# EAGLE design External_Controls_Board (EAGLE 6.6.0)
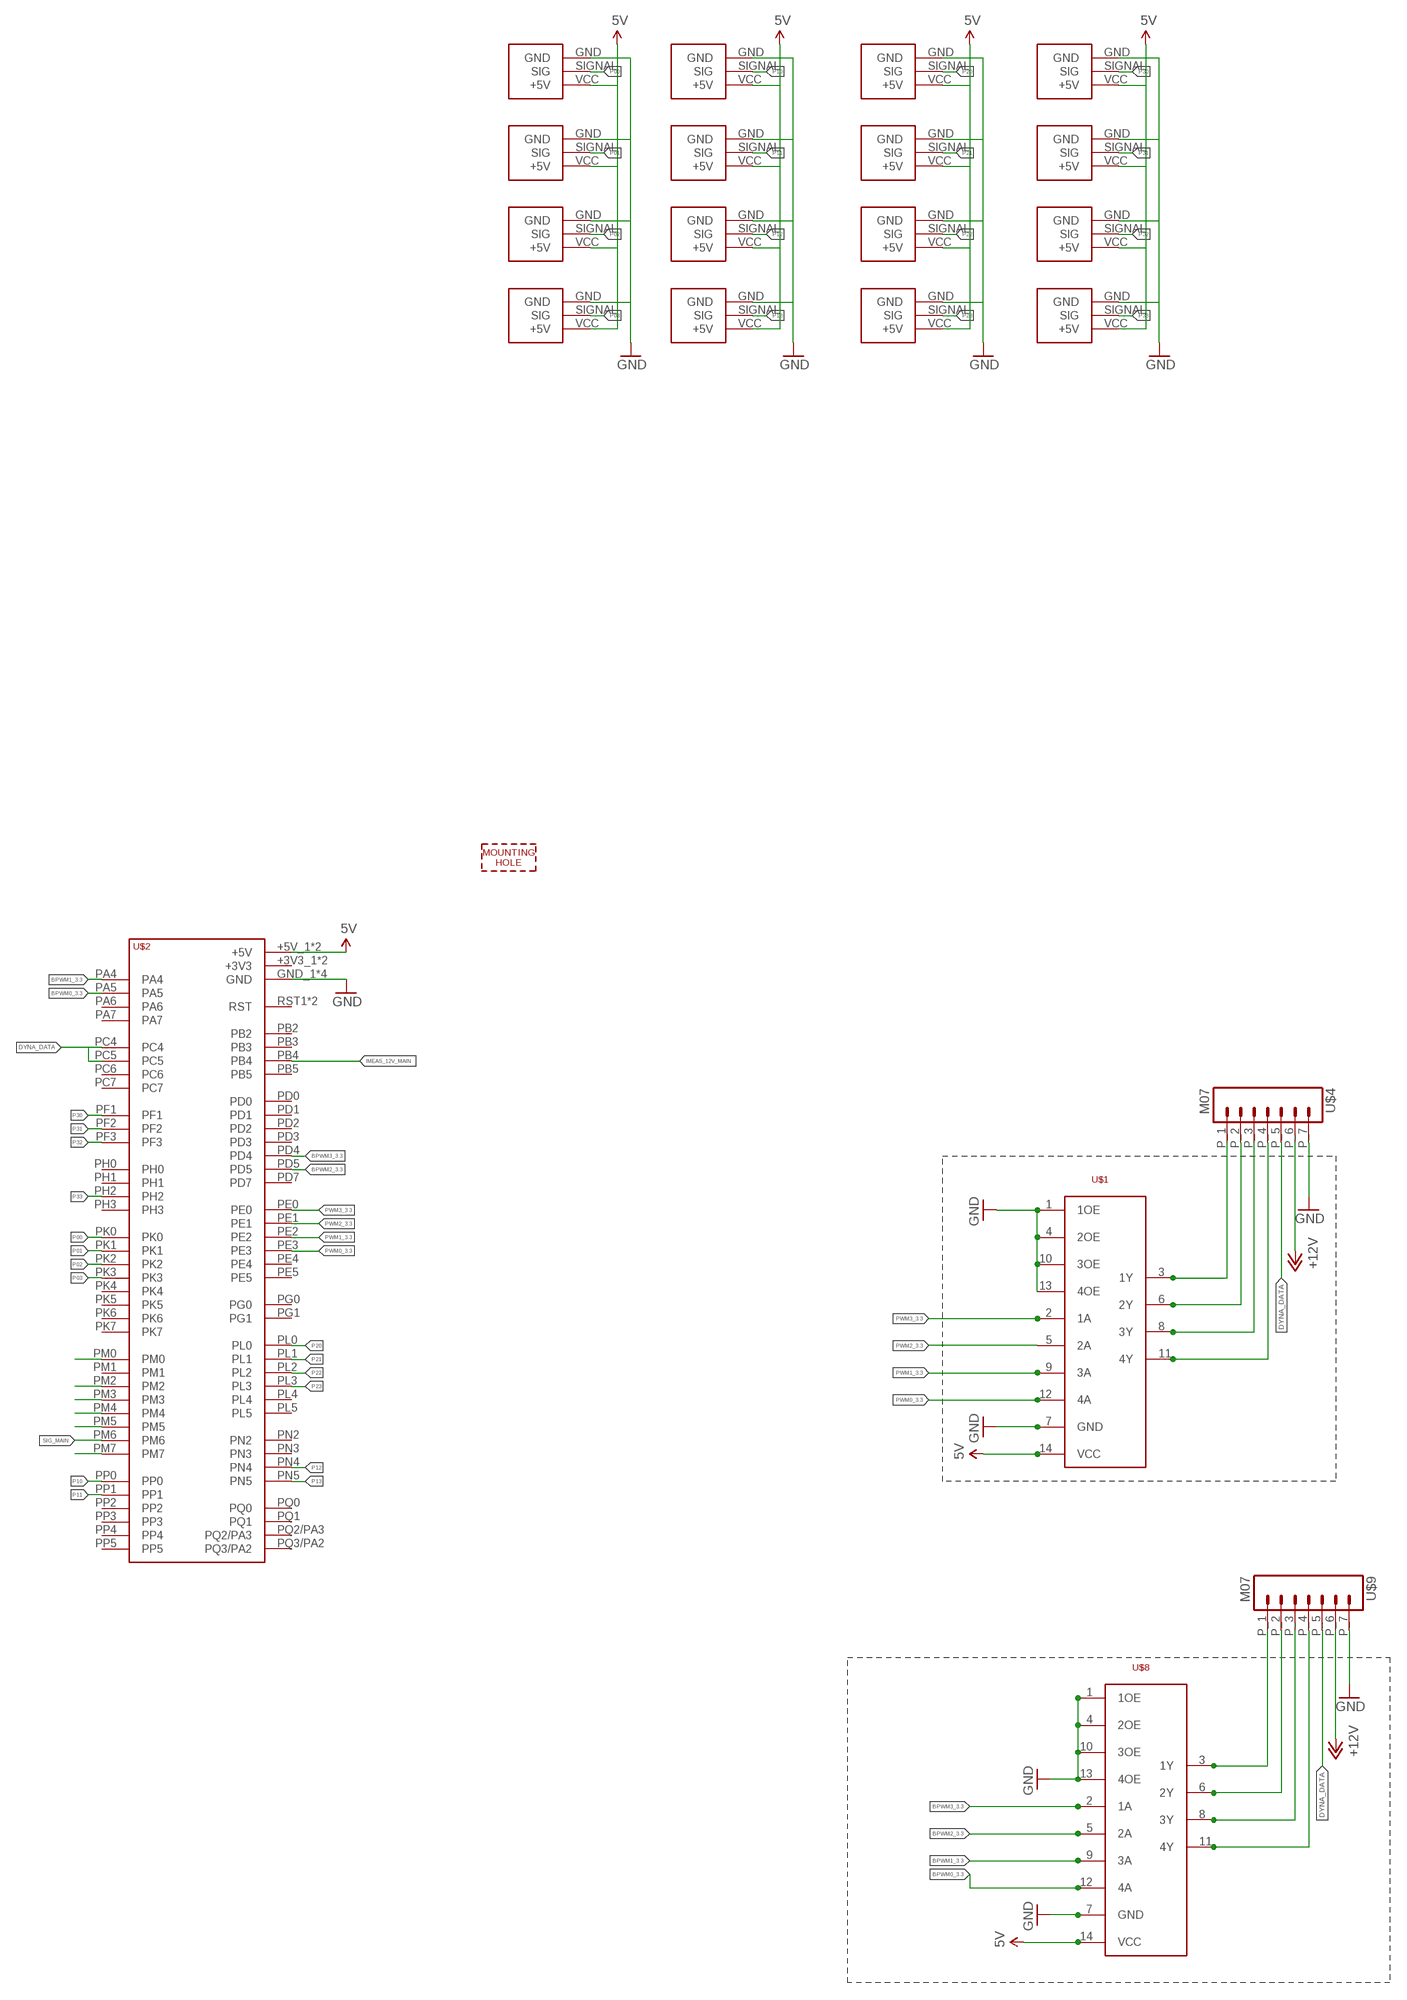
[diagram p0: schematic, sheet 1, part 1 of 2]
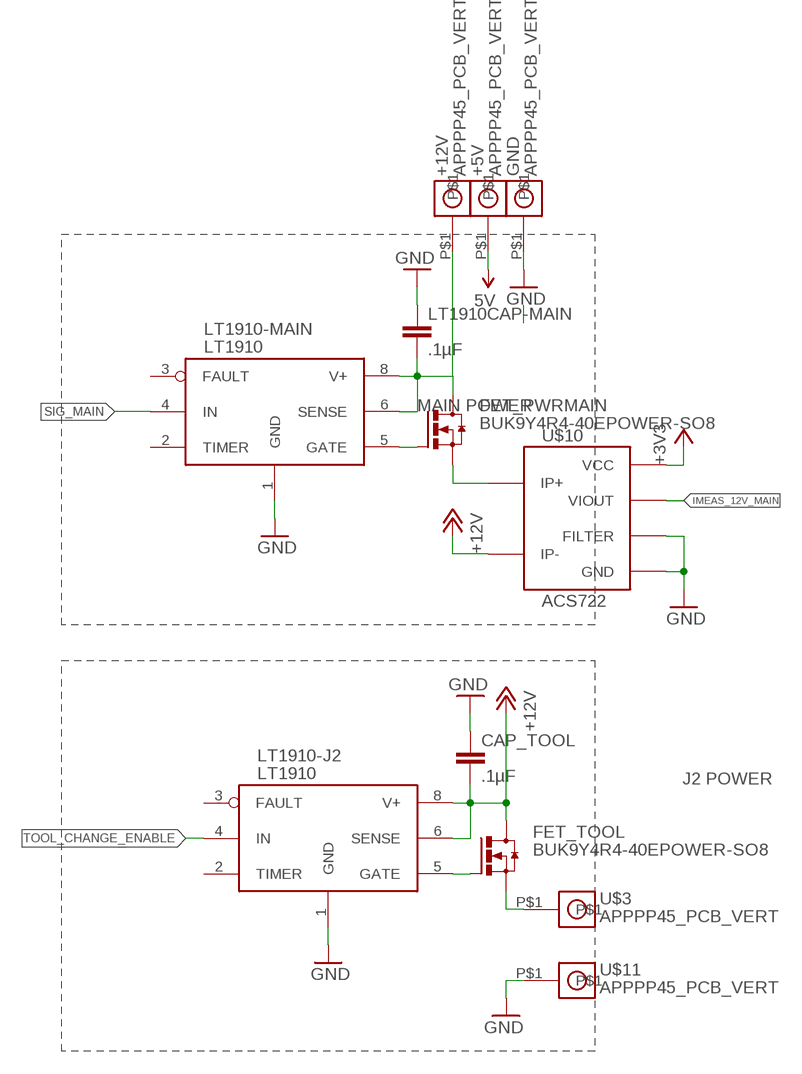
[diagram p1: schematic, sheet 1, part 2 of 2]

## Parts
+5V  APPPP45_PCB_VERT  [APP45_PCB_VERT]
+12V  APPPP45_PCB_VERT  [APP45_PCB_VERT]
CAP_TOOL  .1µF  CAP0603-CAP  [0603-CAP]
FET_PWRMAIN  BUK9Y4R4-40EPOWER-SO8  [POWER-SO8]
FET_TOOL  BUK9Y4R4-40EPOWER-SO8  [POWER-SO8]
GND  APPPP45_PCB_VERT  [APP45_PCB_VERT]
LT1910-J2  LT1910  [SO8]
LT1910-MAIN  LT1910  [SO8]
LT1910CAP-MAIN  .1µF  CAP0603-CAP  [0603-CAP]
S00  SERVO  [SERVO_JACK]
S01  SERVO  [SERVO_JACK]
S02  SERVO  [SERVO_JACK]
S03  SERVO  [SERVO_JACK]
S10  SERVO  [SERVO_JACK]
S11  SERVO  [SERVO_JACK]
S12  SERVO  [SERVO_JACK]
S13  SERVO  [SERVO_JACK]
S20  SERVO  [SERVO_JACK]
S21  SERVO  [SERVO_JACK]
S22  SERVO  [SERVO_JACK]
S23  SERVO  [SERVO_JACK]
S30  SERVO  [SERVO_JACK]
S31  SERVO  [SERVO_JACK]
S32  SERVO  [SERVO_JACK]
S33  SERVO  [SERVO_JACK]
U$1  SN74AHCT125  [SOIC14]
U$2  TIVA-C-CONNECTED  [TIVA-C-CONNECTED]
U$3  APPPP45_PCB_VERT  [APP45_PCB_VERT]
U$4  M07  [MOLEX_43650-07]
U$6  MOUNTING_HOLE#8  [#8_SCREW]
U$8  SN74AHCT125  [SOIC14]
U$9  M07  [MOLEX_43650-07]
U$10  ACS722  [SO-08]
U$11  APPPP45_PCB_VERT  [APP45_PCB_VERT]

## Nets
+3V3: U$10.8(VCC)
+5V: +5V.P$1 S00.VCC(+5V) S01.VCC(+5V) S02.VCC(+5V) S03.VCC(+5V) S10.VCC(+5V) S11.VCC(+5V) S12.VCC(+5V) S13.VCC(+5V) S20.VCC(+5V) S21.VCC(+5V) S22.VCC(+5V) S23.VCC(+5V) S30.VCC(+5V) S31.VCC(+5V) S32.VCC(+5V) S33.VCC(+5V) U$1.14(VCC) U$2.+5V_1(+5V) U$2.+5V_2(+5V) U$8.14(VCC) ; supply symbol labelled 5V
+12V: CAP_TOOL.2 FET_TOOL.5(D) FET_TOOL.6(D) FET_TOOL.7(D) FET_TOOL.8(D) LT1910-J2.6(SENSE) LT1910-J2.8(V+) U$4.P_6 U$9.P_6 U$10.3(IP-) U$10.4(IP-)
BPWM0_3.3: U$2.PA5 U$8.12(4A)
BPWM1_3.3: U$2.PA4 U$8.9(3A)
BPWM2_3.3: U$2.PD5 U$8.5(2A)
BPWM3_3.3: U$2.PD4 U$8.2(1A)
DYNA_DATA: U$2.PC4 U$2.PC5 U$4.P_5 U$9.P_5
GATE-J2: FET_TOOL.4(G) LT1910-J2.5(GATE)
GATE-MAIN: FET_PWRMAIN.4(G) LT1910-MAIN.5(GATE)
GND: CAP_TOOL.1 GND.P$1 LT1910-J2.1(GND) LT1910-MAIN.1(GND) LT1910CAP-MAIN.1 S00.GND S01.GND S02.GND S03.GND S10.GND S11.GND S12.GND S13.GND S20.GND S21.GND S22.GND S23.GND S30.GND S31.GND S32.GND S33.GND U$1.1(1OE) U$1.4(2OE) U$1.7(GND) U$1.10(3OE) U$1.13(4OE) U$2.GND_1(GND) U$2.GND_2(GND) U$2.GND_3(GND) U$2.GND_4(GND) U$4.P_7 U$8.1(1OE) U$8.4(2OE) U$8.7(GND) U$8.10(3OE) U$8.13(4OE) U$9.P_7 U$10.5(GND) U$10.6(FILTER) U$11.P$1
IMEAS_12V_MAIN: U$2.PB4 U$10.7(VIOUT)
N$2: +12V.P$1 FET_PWRMAIN.5(D) FET_PWRMAIN.6(D) FET_PWRMAIN.7(D) FET_PWRMAIN.8(D) LT1910-MAIN.6(SENSE) LT1910-MAIN.8(V+) LT1910CAP-MAIN.2
P00: S00.SIGNAL(SIG) U$2.PK0
P01: S01.SIGNAL(SIG) U$2.PK1
P02: S02.SIGNAL(SIG) U$2.PK2
P03: S03.SIGNAL(SIG) U$2.PK3
P10: S10.SIGNAL(SIG) U$2.PP0
P11: S11.SIGNAL(SIG) U$2.PP1
P12: S12.SIGNAL(SIG) U$2.PN4
P13: S13.SIGNAL(SIG) U$2.PN5
P20: S20.SIGNAL(SIG) U$2.PL0
P21: S21.SIGNAL(SIG) U$2.PL1
P22: S22.SIGNAL(SIG) U$2.PL2
P23: S23.SIGNAL(SIG) U$2.PL3
P30: S30.SIGNAL(SIG) U$2.PF1
P31: S31.SIGNAL(SIG) U$2.PF2
P32: S32.SIGNAL(SIG) U$2.PF3
P33: S33.SIGNAL(SIG) U$2.PH2
PWM0_1: U$8.11(4Y) U$9.P_4
PWM0_3.3: U$1.12(4A) U$2.PE3
PWM0_5: U$1.11(4Y) U$4.P_4
PWM1_1: U$8.8(3Y) U$9.P_3
PWM1_3.3: U$1.9(3A) U$2.PE2
PWM1_5: U$1.8(3Y) U$4.P_3
PWM2_1: U$8.6(2Y) U$9.P_2
PWM2_3.3: U$1.5(2A) U$2.PE1
PWM2_5: U$1.6(2Y) U$4.P_2
PWM3_1: U$8.3(1Y) U$9.P_1
PWM3_3.3: U$1.2(1A) U$2.PE0
PWM3_5: U$1.3(1Y) U$4.P_1
SERVO_SIG_8: U$2.PM0
SERVO_SIG_10: U$2.PM2
SERVO_SIG_11: U$2.PM3
SERVO_SIG_12: U$2.PM4
SERVO_SIG_13: U$2.PM5
SERVO_SIG_15: U$2.PM7
SIG_MAIN: LT1910-MAIN.4(IN) U$2.PM6
SOURCE-MAIN: FET_PWRMAIN.1(S) FET_PWRMAIN.2(S) FET_PWRMAIN.3(S) U$10.1(IP+) U$10.2(IP+)
TOOL: FET_TOOL.1(S) FET_TOOL.2(S) FET_TOOL.3(S) U$3.P$1
TOOL_CHANGE_ENABLE: LT1910-J2.4(IN)
Unconnected: LT1910-J2.2(TIMER) LT1910-J2.3(FAULT) LT1910-MAIN.2(TIMER) LT1910-MAIN.3(FAULT) U$2.+3V3_1(+3V3) U$2.+3V3_2(+3V3) U$2.PA6 U$2.PA7 U$2.PB2 U$2.PB3 U$2.PB5 U$2.PC6 U$2.PC7 U$2.PD0 U$2.PD1 U$2.PD2 U$2.PD3 U$2.PD7 U$2.PE4 U$2.PE5 U$2.PG0 U$2.PG1 U$2.PH0 U$2.PH1 U$2.PH3 U$2.PK4 U$2.PK5 U$2.PK6 U$2.PK7 U$2.PL4 U$2.PL5 U$2.PM1 U$2.PN2 U$2.PN3 U$2.PP2 U$2.PP3 U$2.PP4 U$2.PP5 U$2.PQ0 U$2.PQ1 U$2.PQ2/PA3 U$2.PQ3/PA2 U$2.RST1(RST) U$2.RST_2(RST)

## Notes on the sheet
- MAIN POWER
- J2 POWER

## Library data of the parts
+5V +12V GND U$3 U$11 = MRDT-Connectors:APP: http://www.powerwerx.com/anderson-powerpoles/
CAP_TOOL LT1910CAP-MAIN = SparkFun-Capacitors:CAP: Capacitor Standard 0603 ceramic capacitor, and 0.1" leaded capacitor.
FET_PWRMAIN FET_TOOL = MRDT-2015-General:BUK9Y4R4-40E; MFR: NXP; MFR_PN: BUK9Y4R4-40E; PACKAGE: POWER-SO8
LT1910-J2 LT1910-MAIN = Jake:LT1910
S00 S01-S03 S10-S13 S20-S23 S30-S33 = MRDT-2015-General:SERVO
U$1 U$8 = MRDT-Digital-ICs:SN74AHCT125: part # SN74AHCT125 QUADRUPLE BUS BUFFER GATES WITH 3-STATE OUTPUTS http://www.digikey.com/product-detail/en/SN74AHCT125DR/296-4652-1-ND/405208
U$2 = MRDT-2015-General:TIVA-C-CONNECTED: TIVA C CONNECTED LAUNCHPAD
U$4 U$9 = MRDT-Connectors:M07
U$6 = MRDT-Hardware:MOUNTING_HOLE: Mounting hole for M6 bolt. Standard use mounting hole for: Tiva C Connected - M6 Anderson Powerpole Mounting Wing - M8 Most frame-mounted PCB's - M8
U$10 = MRDT-PowerICs:ACS722

## Board
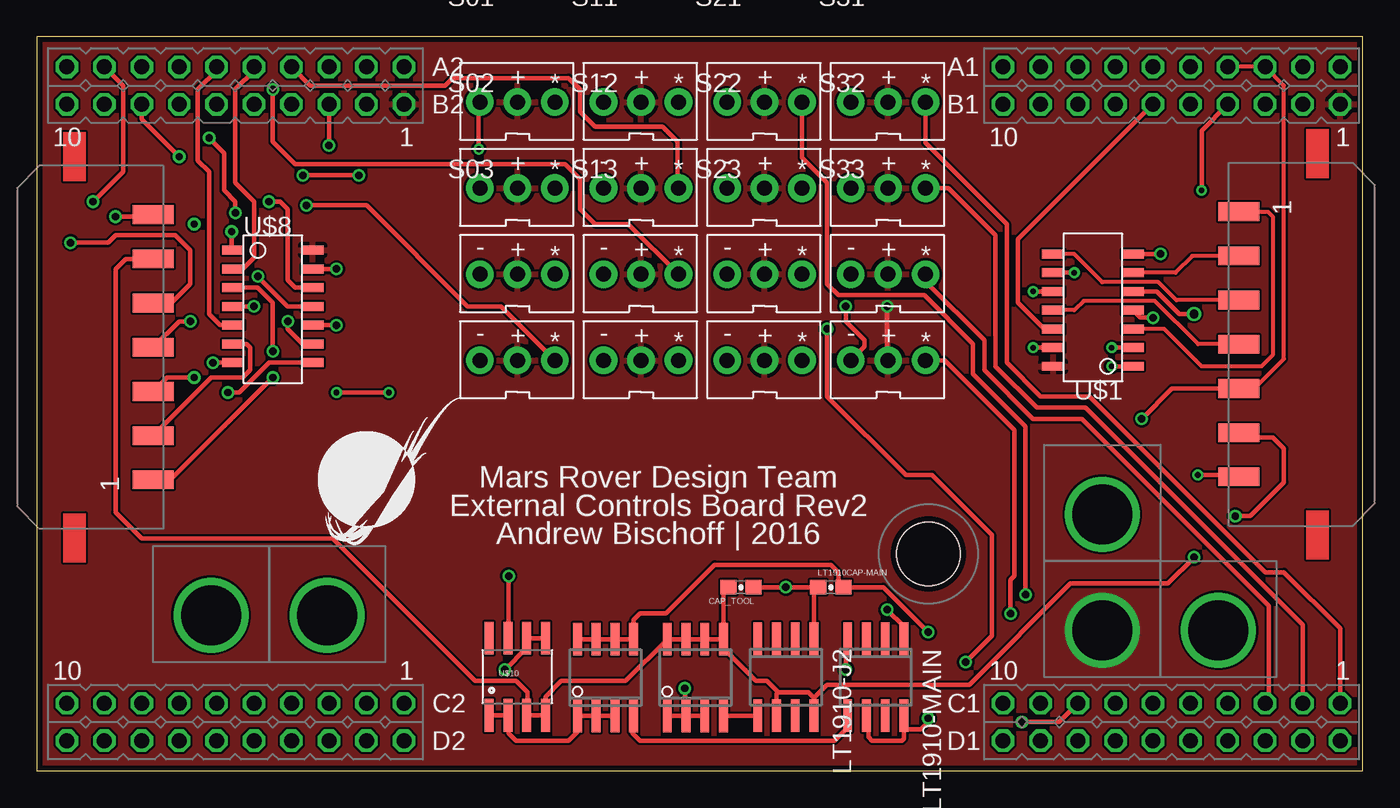
[diagram p2: board, top side]
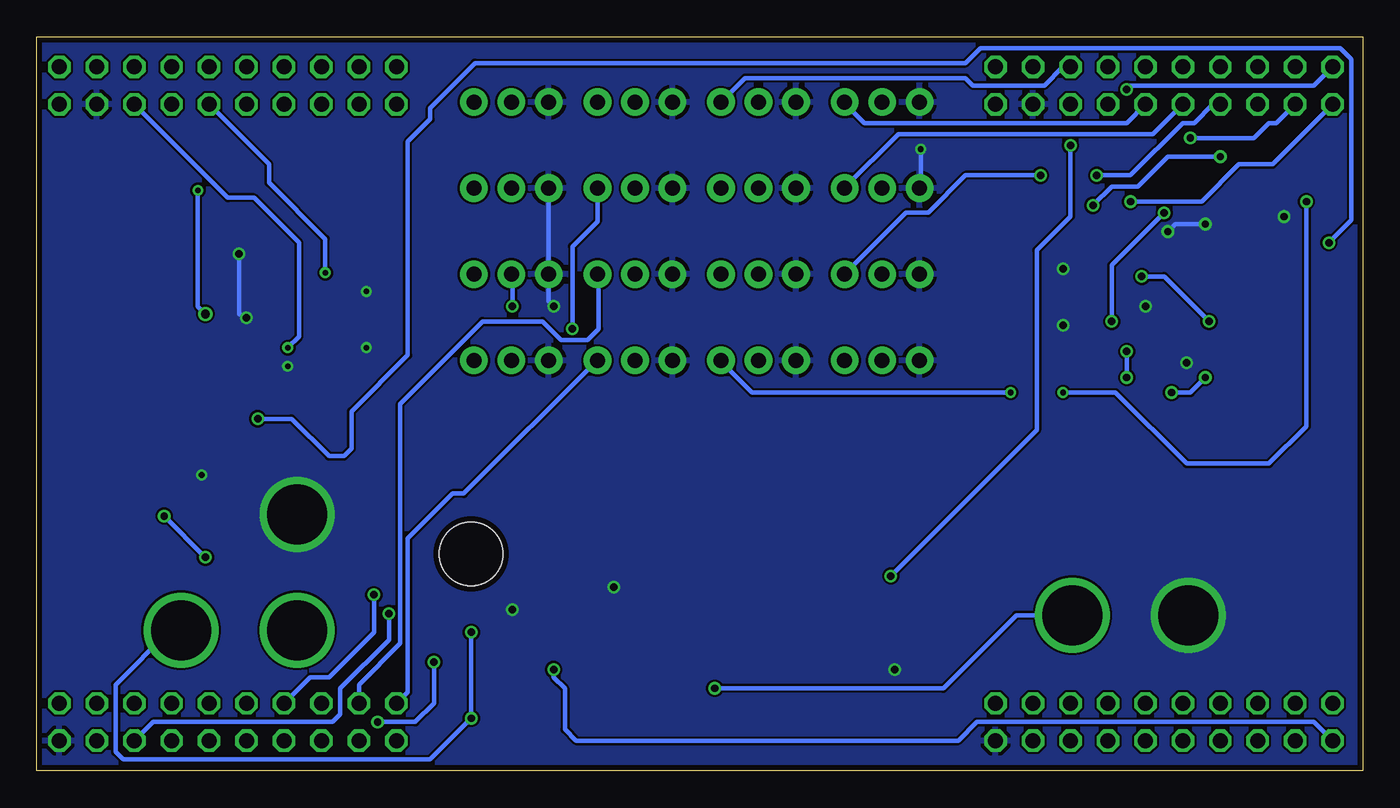
[diagram p3: board, bottom side, seen from below]

Size 89.92 x 49.78 mm. Coordinates in mm from the lower left corner, seen from the top.
Outline: 0,0 89.92,0 89.92,49.78 0,49.78 0,0
Copper layers (1*16): Top 0.0356mm / dielectric 1.5011mm / Bottom 0.0356mm
Design rules "LaenPCBOrder": minimum track width 6mil, minimum drill 13mil, track to track 6mil, track to pad 6mil, pad to pad 6mil, via to via 6mil, smd to smd 6mil, copper to edge 15mil, drill to drill 6mil, minimum pad ring 7mil, minimum via ring 7mil, stop-mask expansion 3mil, vias tented up to drill 0mil, thermal gap 10mil

### Footprints (pad centres in the part's own frame; a part is rotated, then mirrored left to right if it is on the bottom)
APP45_PCB_VERT = drill 4.064: P$1 3.937,3.175
0603-CAP = smd 1.1 x 1: 1 -0.85,0; 2 0.85,0
POWER-SO8 = smd 0.6 x 2.2: 1 0.595,-0.6; 2 1.865,-0.6; 3 3.135,-0.6; 4 4.405,-0.6; 5 4.405,4.6; 6 3.135,4.6; 7 1.865,4.6; 8 0.595,4.6
SO8 = smd 0.6 x 2.2: 1 -1.905,-2.6; 2 -0.635,-2.6; 3 0.635,-2.6; 4 1.905,-2.6; 5 1.905,2.6; 6 0.635,2.6; 7 -0.635,2.6; 8 -1.905,2.6
SERVO_JACK = drill 1.016 pad 1.88: GND -4.24,3.45; SIGNAL 0.84,3.45; VCC -1.7,3.45
SOIC14 = smd 1.5 x 0.6: 1 1.11,10.16; 2 1.11,8.89; 3 1.11,7.62; 4 1.11,6.35; 5 1.11,5.08; 6 1.11,3.81; 7 1.11,2.54; 8 6.51,2.54; 9 6.51,3.81; 10 6.51,5.08; 11 6.51,6.35; 12 6.51,7.62; 13 6.51,8.89; 14 6.51,10.16
TIVA-C-CONNECTED = drill 1.016 octagon: +3V3_1 59.69,54.61; +3V3_2 123.19,54.61; +5V_1 59.69,52.07; +5V_2 123.19,52.07; GND_1 57.15,52.07; GND_2 59.69,8.89; GND_3 120.65,52.07; GND_4 123.19,8.89; PA4 39.37,52.07; PA5 36.83,52.07; PA6 105.41,52.07; PA7 52.07,8.89; PB2 102.87,54.61; PB3 100.33,54.61; PB4 54.61,52.07; PB5 52.07,52.07; PC4 118.11,54.61; PC5 115.57,54.61; PC6 113.03,54.61; PC7 105.41,54.61; PD0 107.95,8.89; PD1 110.49,8.89; PD2 57.15,54.61; PD3 107.95,54.61; PD4 49.53,54.61; PD5 46.99,54.61; PD7 107.95,52.07; PE0 118.11,52.07; PE1 115.57,52.07; PE2 113.03,52.07; PE3 110.49,52.07; PE4 120.65,54.61; PE5 110.49,54.61; PF1 123.19,11.43; PF2 120.65,11.43; PF3 118.11,11.43; PG0 115.57,11.43; PG1 59.69,11.43; PH0 44.45,11.43; PH1 41.91,11.43; PH2 118.11,8.89; PH3 115.57,8.89; PK0 49.53,52.07; PK1 46.99,52.07; PK2 44.45,52.07; PK3 41.91,52.07; PK4 57.15,11.43; PK5 54.61,11.43; PK6 39.37,11.43; PK7 36.83,11.43; PL0 107.95,11.43; PL1 105.41,11.43; PL2 102.87,11.43; PL3 100.33,11.43; PL4 113.03,11.43; PL5 110.49,11.43; PM0 52.07,11.43; PM1 49.53,11.43; PM2 46.99,11.43; PM3 120.65,8.89; PM4 102.87,52.07; PM5 100.33,52.07; PM6 36.83,8.89; PM7 57.15,8.89; PN2 105.41,8.89; PN3 102.87,8.89; PN4 36.83,54.61; PN5 39.37,54.61; PP0 54.61,54.61; PP1 52.07,54.61; PP2 100.33,8.89; PP3 41.91,8.89; PP4 41.91,54.61; PP5 54.61,8.89; PQ0 44.45,54.61; PQ1 39.37,8.89; PQ2/PA3 46.99,8.89; PQ3/PA2 44.45,8.89; RST1 49.53,8.89; RST_2 113.03,8.89
MOLEX_43650-07 = smd 1.27 x 2.794: P_1 8.966,4.851; P_2 5.969,4.851; P_3 2.972,4.851; P_4 -0.025,4.851; P_5 -3.023,4.851; P_6 -6.02,4.851; P_7 -9.017,4.851
#8_SCREW = hole 4.318: 0,0
SO-08 = smd 0.61 x 2.21: 1 0.457,-0.813; 2 1.727,-0.813; 3 2.997,-0.813; 4 4.267,-0.813; 5 4.267,4.419; 6 2.997,4.419; 7 1.727,4.419; 8 0.457,4.419

### Placement (x,y rotation side)
+5V  68.33,6.35 0 top
+12V  76.2,6.35 0 top
CAP_TOOL  47.75,12.45 180 top
FET_PWRMAIN  36.07,4.32 0 top
FET_TOOL  42.16,4.32 0 top
GND  7.87,7.37 0 top
LT1910-J2  50.8,6.35 180 top
LT1910-MAIN  56.9,6.35 180 top
LT1910CAP-MAIN  53.85,12.45 0 top
S00  34.29,41.91 0 top
S01  34.29,36.07 0 top
S02  34.29,30.23 0 top
S03  34.29,24.38 0 top
S10  42.67,41.91 0 top
S11  42.67,36.07 0 top
S12  42.67,30.23 0 top
S13  42.67,24.38 0 top
S20  51.05,41.91 0 top
S21  51.05,36.07 0 top
S22  51.05,30.23 0 top
S23  51.05,24.38 0 top
S30  59.44,41.91 0 top
S31  59.44,36.07 0 top
S32  59.44,30.23 0 top
S33  59.44,24.38 0 top
U$1  75.44,37.59 180 top
U$2  -34.8,-6.86 0 top
U$3  15.75,7.37 0 top
U$4  86.36,28.96 90 top
U$5  MOUNTING_HOLE#8  [#8_SCREW]  60.48,14.71 0 top
U$6  12.17,58.12 0 top  (outside the outline)
U$7  [MRDT_LOGO]  19.05,14.48 0 top
U$8  12.19,25.15 0 top
U$9  3.05,28.7 270 top
U$10  30.23,4.57 0 top
U$11  68.33,14.22 0 top

### Tracks (layer width: path | path; a pad name or v marks a point on that pad's centre or on a via)
+5V  (via drill 0.5)
  Top 0.305: v57.66,31.5 57.66,27.91 S33.VCC
  Bottom 0.305: S32.VCC 57.74,33.61 57.66,33.53 v57.66,31.5
  pour Top: -38.35,-8.13 -38.35,53.59 92.96,53.59 92.96,-8.13
+12V  (via drill 0.5)
  Top 0.305: U$9.P_6 6.02,34.72 5.33,34.04 5.33,17.53 7.11,15.75 20.07,15.75 29.72,6.1 32.51,6.1 33.27,5.33 33.27,3.81 U$10.3 U$10.4 34.49,5.03 35.56,6.1 39.94,6.1 FET_TOOL.8 FET_TOOL.7 FET_TOOL.6 FET_TOOL.5 | FET_TOOL.5 46.57,12.11 CAP_TOOL.2 | FET_TOOL.5 46.57,8.3 48.77,6.1 49.53,6.1 50.29,5.33 | LT1910-J2.8 52.7,4.95 | 52.7,4.95 52.32,5.33 50.29,5.33 | LT1910-J2.6 50.16,5.21 50.29,5.33 | 52.7,4.95 53.59,5.84 63.25,5.84 70.1,12.7 76.71,12.7 v78.49,14.48 | v81.28,17.27 82.3,17.27 84.58,19.56 84.58,21.84 83.82,22.61 81.84,22.61 U$4.P_6
  Bottom 0.305: v78.49,14.48 v81.28,17.27
BPWM0_3.3  (via drill 0.5)
  Top 0.305: v15.75,38.61 16.51,38.61 17.02,38.1 17.02,33.27 17.53,32.77 U$8.12
  Bottom 0.305: v15.75,38.61 10.92,38.61 8.38,41.15 6.1,41.15 U$2.PA5
BPWM1_3.3  (via drill 0.5)
  Top 0.305: v13.46,37.85 13.46,38.61 12.7,39.37 12.7,41.91 v11.68,42.93 | v17.02,30.48 17.02,29.97 18.03,28.96 U$8.9
  Bottom 0.305: v17.02,30.48 17.02,34.29 v13.46,37.85 | v11.68,42.93 7.37,42.93 6.35,43.94 5.84,43.94 U$2.PA4
BPWM2_3.3
  Top 0.305: U$2.PD5 12.19,47.5 10.92,46.23 10.92,41.4 11.68,40.64 11.68,30.99 12.45,30.23 U$8.5
BPWM3_3.3
  Top 0.305: U$2.PD4 14.73,47.5 13.46,46.23 13.46,39.88 14.73,38.61 14.73,34.8 13.97,34.04 U$8.2
DYNA_DATA  (via drill 0.5)
  Top 0.279: U$4.P_5 82.58,25.93 84.58,27.94 84.58,46.48 U$2.PC4 U$2.PC5
  Top 0.305: U$4.P_5 76.99,25.93 v74.93,23.88 | v2.29,35.81 4.83,35.81 5.33,36.32 9.4,36.32 10.41,35.31 10.41,33.02 9.14,31.75 7.92,31.75 U$9.P_5
  Bottom 0.305: v74.93,23.88 72.64,23.88 70.1,21.34 69.09,21.34 68.58,21.84 68.58,24.38 64.77,28.19 64.77,42.67 63.25,44.2 63.25,44.96 60.2,48.01 26.92,48.01 25.91,49.02 1.52,49.02 0.76,48.26 0.76,37.34 v2.29,35.81
GATE-J2
  Top 0.305: FET_TOOL.4 48.86,3.72 LT1910-J2.5
GATE-MAIN
  Top 0.305: LT1910-MAIN.5 54.99,2.92 54.1,2.03 40.89,2.03 40.39,2.54 40.39,3.63 FET_PWRMAIN.4
GND  (via drill 0.38, 0.38 pad 0.38, 0.5, 0.5 pad 0.38)
  Top 0.305: U$4.P_7 81.41,19.94 81.28,20.07 v78.74,20.07 | U$1.13 v67.56,28.7 | U$1.10 v67.56,32.51 | U$1.1 v72.9,27.43 | U$1.7 v76.2,35.05 | v75.69,30.73 74.84,30.73 U$1.4 | U$9.P_7 7.49,37.72 7.37,37.59 | 7.37,37.59 7.87,37.59 | 7.37,37.59 v5.33,37.59 | U$8.13 v20.32,34.04 | U$8.10 v20.32,30.23 | U$8.1 13.21,35.31 v13.21,36.58 | v10.67,37.08 10.41,37.08 | U$8.7 v11.94,27.69 | U$8.4 v14.73,31.5 | CAP_TOOL.1 v50.8,12.45 LT1910CAP-MAIN.1 52.7,12.15 LT1910-J2.1 | U$10.5 U$10.6 33.22,8.33 v31.75,6.86 | LT1910-MAIN.1 58.8,9.78 v57.66,10.92 | v54.86,31.5 54.86,30.48 56.13,29.21 56.13,28.77 S33.GND | S00.GND 30.05,45.29 29.97,45.21 v29.97,42.16
  Bottom 0.305: v76.2,35.05 76.2,30.99 v75.69,30.73 | v5.33,37.59 5.08,37.59 | v20.32,34.04 20.57,34.04 | v20.32,30.23 20.57,30.23 | v13.21,36.58 12.7,37.08 v10.67,37.08 | v11.94,27.69 11.68,27.69 | v14.73,31.5 14.99,31.5 | v50.8,12.45 50.8,12.7 | v57.66,10.92 57.4,10.92 | 55.12,39.37 55.2,39.29 S32.GND 55.2,31.83 v54.86,31.5 | v29.97,42.16 29.97,39.6 S01.GND
  pour Bottom: -34.8,-17.02 92.2,-17.02 92.2,51.56 -34.8,51.56
IMEAS_12V_MAIN  (via drill 0.5)
  Top 0.305: U$2.PB4 v19.81,42.42 | v32,13.21 32,9.04 U$10.7
  Bottom 0.305: v19.81,42.42 19.81,37.59 22.1,35.31 22.1,23.11 v32,13.21
N$2  (via drill 0.5)
  Top 0.305: FET_PWRMAIN.8 FET_PWRMAIN.7 FET_PWRMAIN.6 FET_PWRMAIN.5 40.47,10.25 40.89,10.67 42.67,10.67 45.97,13.97 53.85,13.97 54.36,13.46 54.36,12.79 LT1910CAP-MAIN.2 57.4,12.45 v60.45,9.4 | v60.45,3.56 60.45,3.3 59.94,2.79 58.93,2.79 58.93,3.62 LT1910-MAIN.8 58.8,2.16 58.67,2.03 56.64,2.03 56.39,2.29 56.39,3.62 LT1910-MAIN.6
  Bottom 0.305: v60.45,9.4 v60.45,3.56 63.25,0.76 84.07,0.76 84.58,1.27 84.58,5.84 80.9,9.52 +12V.P$1
P00
  Bottom 0.305: S00.SIGNAL 35.13,45.29 33.78,43.94 16,43.94 U$2.PK0
P01
  Bottom 0.305: U$2.PK1 14.22,43.18 31.5,43.18 35.13,39.55 S01.SIGNAL
P02  (via drill 0.5)
  Top 0.305: v18.03,40.39 v21.84,40.39
  Bottom 0.305: U$2.PK2 10.16,45.21 11.43,43.94 12.19,43.94 15.75,40.39 v18.03,40.39 | S02.SIGNAL 30.96,37.85 29.46,37.85 26.92,40.39 v21.84,40.39
P03  (via drill 0.5)
  Top 0.305: U$2.PK3 7.11,44.2 v9.65,41.66 | v18.29,38.35 22.35,38.35 29.21,31.5 31.47,31.5 S03.SIGNAL
  Bottom 0.305: v9.65,41.66 13.21,41.66 15.24,39.62 17.02,39.62 v18.29,38.35
P10
  Bottom 0.305: U$2.PP0 20.32,47.75 21.59,46.48 26.42,46.48 26.92,46.99 41.88,46.99 S10.SIGNAL
P11
  Top 0.305: U$2.PP1 18.54,46.48 27.69,46.48 28.19,46.99 36.07,46.99 36.83,46.23 36.83,44.7 37.85,43.69 42.42,43.69 43.43,42.67 43.43,39.6 S11.SIGNAL
P12  (via drill 0.5)
  Top 0.305: v16,46.23 16,42.67 17.53,41.15 35.81,41.15 36.83,40.13 36.83,38.1 37.85,37.08 40.1,37.08 S12.SIGNAL
  Bottom 0.305: U$2.PN4 3.3,46.48 15.75,46.48 v16,46.23
P13  (via drill 0.38, 0.5)
  Top 0.305: v3.81,38.61 5.84,40.64 5.84,46.48 U$2.PN5 | v20.32,25.65 v23.88,25.65
  Bottom 0.305: S13.SIGNAL 43.51,27.76 41.4,25.65 v23.88,25.65 | v20.32,25.65 16.76,25.65 11.94,20.83 6.35,20.83 3.81,23.37 v3.81,38.61
P20  (via drill 0.5)
  Top 0.305: S20.SIGNAL 51.89,41.58 53.59,39.88 53.59,33.02 54.36,32.26 60.2,32.26 63.5,28.96 63.5,26.92 67.06,23.37 v67.06,11.94
  Bottom 0.305: v67.06,11.94 67.06,9.4 70.1,6.35 71.37,6.35 U$2.PL0
P21  (via drill 0.5)
  Top 0.305: v53.59,29.97 53.59,25.4 58.93,20.07 60.71,20.07 64.77,16 64.77,9.14 v62.99,7.37 | U$2.PL1 69.34,3.3 v66.8,3.3
  Bottom 0.305: S21.SIGNAL 51.89,37.26 53.59,35.56 v53.59,29.97 | v62.99,7.37 62.99,4.57 64.26,3.3 v66.8,3.3
P22
  Bottom 0.305: U$2.PL2 68.07,5.84 65.28,8.64 65.28,24.89 59.69,30.48 55.63,30.48 54.36,29.21 52.58,29.21 51.82,29.97 51.82,33.6 S22.SIGNAL
P23
  Bottom 0.305: S23.SIGNAL 51.92,27.83 60.96,18.8 61.72,18.8 64.77,15.75 64.77,5.33 U$2.PL3
P30
  Top 0.305: S30.SIGNAL 60.28,42.59 65.79,37.08 65.79,27.69 68.07,25.4 71.37,25.4 83.31,13.46 84.58,13.46 88.39,9.65 U$2.PF1
P31
  Top 0.305: S31.SIGNAL 61.83,39.52 65.02,36.32 65.02,27.43 67.82,24.64 71.12,24.64 85.85,9.91 U$2.PF2
P32
  Top 0.305: S32.SIGNAL 60.28,33.2 64.26,29.21 64.26,27.18 67.56,23.88 70.87,23.88 83.57,11.18 83.57,4.83 U$2.PF3
P33  (via drill 0.5)
  Top 0.305: S33.SIGNAL 61.57,27.83 66.29,23.11 66.29,13.21 66.04,12.95 v66.04,10.67
  Bottom 0.305: v66.04,10.67 66.04,8.89 69.34,5.59 69.34,3.81 69.85,3.3 82.04,3.3 U$2.PH2
PWM0_1  (via drill 0.5)
  Top 0.305: U$8.11 17.02,31.5 v14.99,33.53 | v10.41,30.48 9.65,30.48 U$9.P_4
  Bottom 0.305: v14.99,33.53 13.46,33.53 v10.41,30.48
PWM0_3.3
  Top 0.305: U$1.12 68.33,29.97 66.55,31.75 66.55,36.07 U$2.PE3
PWM0_5
  Top 0.279: U$4.P_4 78.77,28.93 75.82,31.88 70.99,31.88 70.36,31.24 U$1.11
PWM1_1  (via drill 0.5)
  Top 0.305: U$8.8 15.75,27.69 13.72,25.65 v12.95,25.65 | v10.67,26.67 8.84,26.67 U$9.P_3
  Bottom 0.305: v12.95,25.65 11.68,25.65 v10.67,26.67
PWM1_3.3  (via drill 0.38)
  Top 0.305: U$1.9 v70.36,33.78
  Bottom 0.305: v70.36,33.78 70.36,36.07 74.17,39.88 74.17,41.15 U$2.PE2
PWM1_5
  Top 0.279: U$4.P_3 77.29,31.93 76.07,33.15 72.26,33.15 70.36,35.05 U$1.8
PWM2_1
  Top 0.305: U$8.6 14.22,28.96 14.48,28.7 14.48,27.18 13.97,26.67 11.84,26.67 U$9.P_2
PWM2_3.3  (via drill 0.38, 0.6 pad 0.38)
  Top 0.305: U$1.5 75.95,32.51 77.47,30.99 v78.49,30.99 | v78.99,39.37 78.99,43.43 U$2.PE1
  Bottom 0.305: v78.49,30.99 78.99,31.5 v78.99,39.37
PWM2_5
  Top 0.279: U$4.P_2 78.36,34.93 77.22,33.78 U$1.6
PWM3_1  (via drill 0.5)
  Top 0.305: U$8.3 14.99,32.77 16,31.75 v16,28.45 | v16,26.67 9.14,19.81 7.98,19.81 U$9.P_1
  Bottom 0.305: v16,28.45 v16,26.67
PWM3_3.3  (via drill 0.38)
  Top 0.305: U$1.2 v72.9,28.7
  Bottom 0.305: v72.9,28.7 72.14,29.46 72.14,35.81 75.18,38.86 76.96,38.86 U$2.PE0
PWM3_5
  Top 0.279: U$4.P_1 83.49,37.92 83.82,37.59 83.82,28.19 83.06,27.43 78.99,27.43 76.45,29.97 U$1.3
SIG_MAIN  (via drill 0.5)
  Top 0.305: LT1910-MAIN.4 54.99,8.76 54.86,8.64 v54.86,6.86
  Bottom 0.305: v54.86,6.86 54.86,6.35 54.1,5.59 54.1,2.79 53.34,2.03 27.43,2.03 26.16,3.3 3.3,3.3 U$2.PM6
SOURCE-MAIN
  Top 0.305: FET_PWRMAIN.3 FET_PWRMAIN.2 FET_PWRMAIN.1 36.66,2.63 36.07,2.03 32.51,2.03 32,2.54 32,3.71 U$10.2 U$10.1
TOOL  (via drill 0.5)
  Top 0.305: FET_TOOL.1 FET_TOOL.2 | FET_TOOL.2 FET_TOOL.3 | v43.94,5.59 43.94,3.81 FET_TOOL.2
  Bottom 0.305: U$3.P$1 23.49,10.54 28.45,5.59 v43.94,5.59

### Text on the board
tPlace: Mars Rover Design Team / External Controls Board Rev2 / Andrew Bischoff | 2016